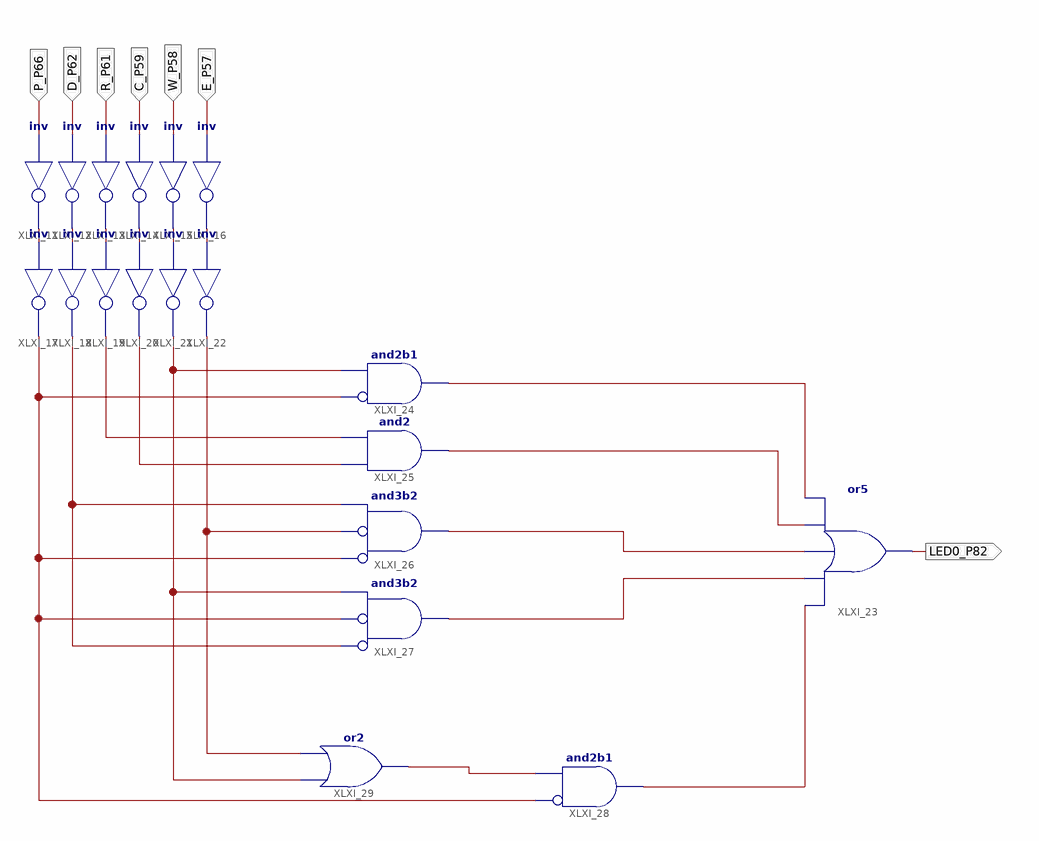
[diagram p0: schematic sheet 1]
// Xilinx ISE schematic test1_1.sch (spartan6) as structural Verilog: 19 symbols, 7 ports
module test1_1 (
  input  P_P66,
  input  D_P62,
  input  R_P61,
  input  C_P59,
  input  W_P58,
  input  E_P57,
  output LED0_P82
);

  wire XLXN_16, XLXN_17, XLXN_18, XLXN_20, XLXN_21, XLXN_22, XLXN_23, XLXN_24, XLXN_26, XLXN_27, XLXN_28,
       XLXN_29, XLXN_33, XLXN_34, XLXN_35, XLXN_36, XLXN_37, XLXN_39;

  not XLXI_11 (XLXN_16, P_P66);
  not XLXI_12 (XLXN_17, D_P62);
  not XLXI_13 (XLXN_18, R_P61);
  not XLXI_14 (XLXN_20, C_P59);
  not XLXI_15 (XLXN_21, W_P58);
  not XLXI_16 (XLXN_22, E_P57);
  not XLXI_17 (XLXN_24, XLXN_16);
  not XLXI_18 (XLXN_39, XLXN_17);
  not XLXI_19 (XLXN_26, XLXN_18);
  not XLXI_20 (XLXN_27, XLXN_20);
  not XLXI_21 (XLXN_28, XLXN_21);
  not XLXI_22 (XLXN_29, XLXN_22);
  or XLXI_23 (LED0_P82, XLXN_37, XLXN_35, XLXN_34, XLXN_33, XLXN_23);
  and XLXI_24 (XLXN_23, ~XLXN_24, XLXN_28);  // and2b1
  and XLXI_25 (XLXN_33, XLXN_27, XLXN_26);
  and XLXI_26 (XLXN_34, ~XLXN_24, ~XLXN_29, XLXN_39);  // and3b2
  and XLXI_27 (XLXN_35, ~XLXN_39, ~XLXN_24, XLXN_28);  // and3b2
  and XLXI_28 (XLXN_37, ~XLXN_24, XLXN_36);  // and2b1
  or XLXI_29 (XLXN_36, XLXN_28, XLXN_29);
endmodule
